# EAGLE design wordclock_final (EAGLE 7.1.0)
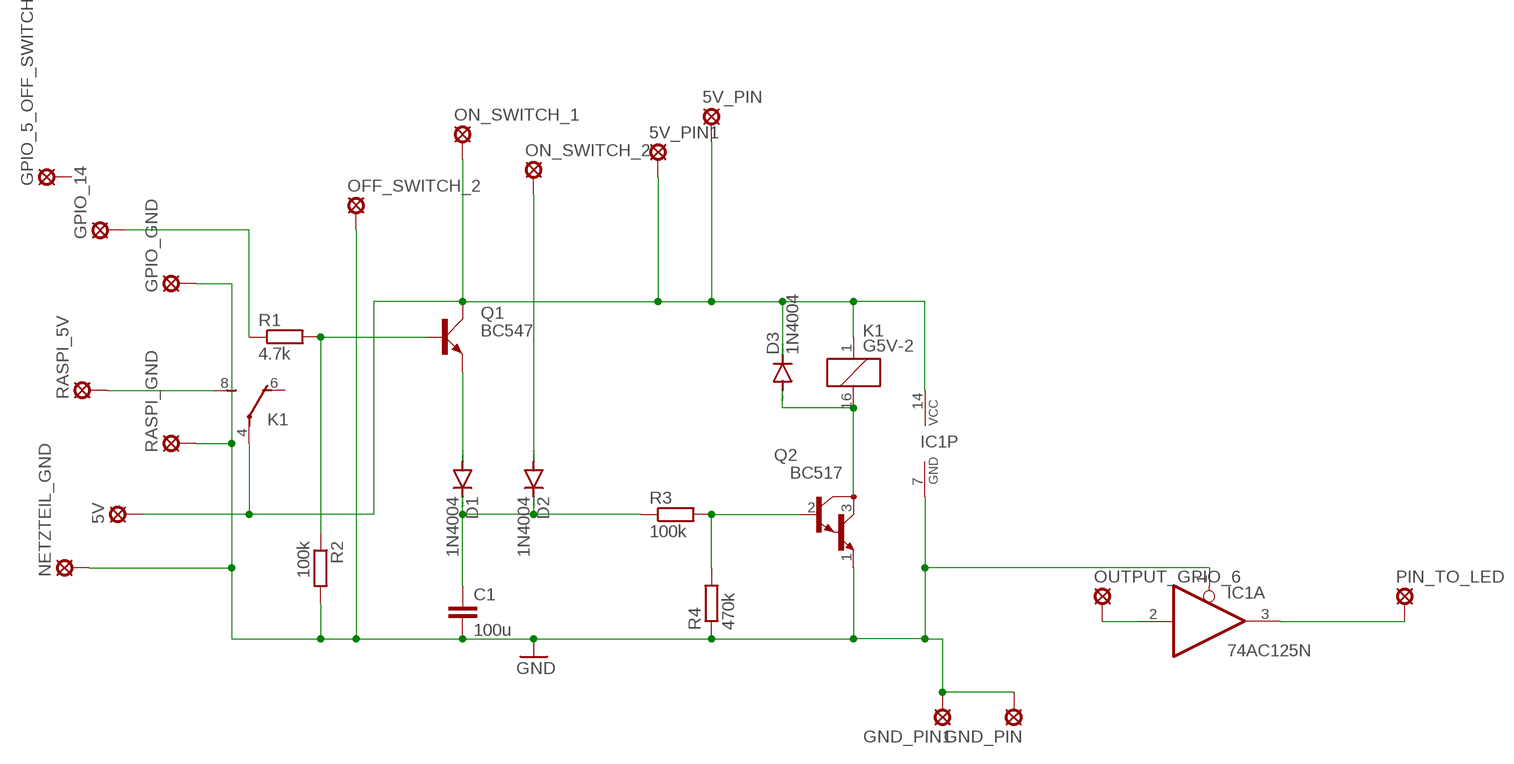
[diagram p0: schematic, sheet 1]

## Parts
5V  SE14  [SE14]
5V_PIN  SE14  [SE14]
5V_PIN1  SE14  [SE14]
C1  100u  C-EU025-060X050  [C025-060X050]
D1  1N4004  [DO41-10]
D2  1N4004  [DO41-10]
D3  1N4004  [DO41-10]
GND_PIN  SE14  [SE14]
GND_PIN1  SE14  [SE14]
GPIO_5_OFF_SWITCH  SE14  [SE14]
GPIO_14  SE14  [SE14]
GPIO_GND  SE14  [SE14]
IC1  74AC125N  [DIL14]
K1  G5V-2  [G5V-2]
NETZTEIL_GND  SE14  [SE14]
OFF_SWITCH_2  SE14  [SE14]
ON_SWITCH_1  SE14  [SE14]
ON_SWITCH_2  SE14  [SE14]
OUTPUT_GPIO_6  SE14  [SE14]
PIN_TO_LED  SE14  [SE14]
Q1  BC547  [SOT54A]
Q2  BC517  [TO92]
R1  4.7k  R-EU_0207/10  [0207/10]
R2  100k  R-EU_0207/10  [0207/10]
R3  100k  R-EU_0207/10  [0207/10]
R4  470k  R-EU_0207/10  [0207/10]
RASPI_5V  SE14  [SE14]
RASPI_GND  SE14  [SE14]

## Nets
GND: C1.2 GND_PIN1.MP GND_PIN.MP GPIO_GND.MP IC1.1(A:OE) IC1.7(P:GND) NETZTEIL_GND.MP OFF_SWITCH_2.MP Q2.1(E) R2.2 R4.1 RASPI_GND.MP
N$1: Q1.B R1.2 R2.1
N$2: D1.A Q1.E
N$3: D2.A ON_SWITCH_2.MP
N$4: IC1.2(A:I) OUTPUT_GPIO_6.MP
N$5: Q2.2(B) R3.2 R4.2
N$6: D3.A K1.16 Q2.3(C)
N$7: 5V.MP 5V_PIN1.MP 5V_PIN.MP D3.C IC1.14(P:VCC) K1.1 K1.4(1:P) ON_SWITCH_1.MP Q1.C
N$8: C1.1 D1.C D2.C R3.1
N$10: GPIO_14.MP R1.1
N$11: K1.8(1:S) RASPI_5V.MP
N$12: IC1.3(A:O) PIN_TO_LED.MP
Unconnected: GPIO_5_OFF_SWITCH.MP IC1.4(B:OE) IC1.5(B:I) IC1.6(B:O) IC1.8(C:O) IC1.9(C:I) IC1.10(C:OE) IC1.11(D:O) IC1.12(D:I) IC1.13(D:OE) K1.6(1:O) K1.9(2:S) K1.11(2:O) K1.13(2:P)

## Library data of the parts
5V 5V_PIN 5V_PIN1 GND_PIN GND_PIN1 GPIO_5_OFF_SWITCH GPIO_14 GPIO_GND NETZTEIL_GND OFF_SWITCH_2 ON_SWITCH_1 ON_SWITCH_2 OUTPUT_GPIO_6 PIN_TO_LED RASPI_5V RASPI_GND = solpad:SE14: SOLDER PAD E1553, drill 1,4mm, distributor Buerklin, 07F820
C1 = rcl:C-EU: CAPACITOR, European symbol; SPICEPREFIX: C
D1-D3 = diode:1N4004: DIODE general purpose rectifier, 1 A
IC1 = 74xx-eu:74*125: Quad bus BUFFER, 3-state
K1 = relay:G5V-2: OMRON PCB Relay Source: http://www.omron.com/ecb/products/pdf/en-g5v2.pdf; MPN: G5V-2 5DC; OC_FARNELL: 9949488; OC_NEWARK: 78K5703
Q1 = transistor-small-signal:BC547: NPN TRANSISTOR
Q2 = transistor-npn:BC517*: NPN Darlington Transistor
R1-R4 = rcl:R-EU_: RESISTOR, European symbol; SPICEPREFIX: R

## Board
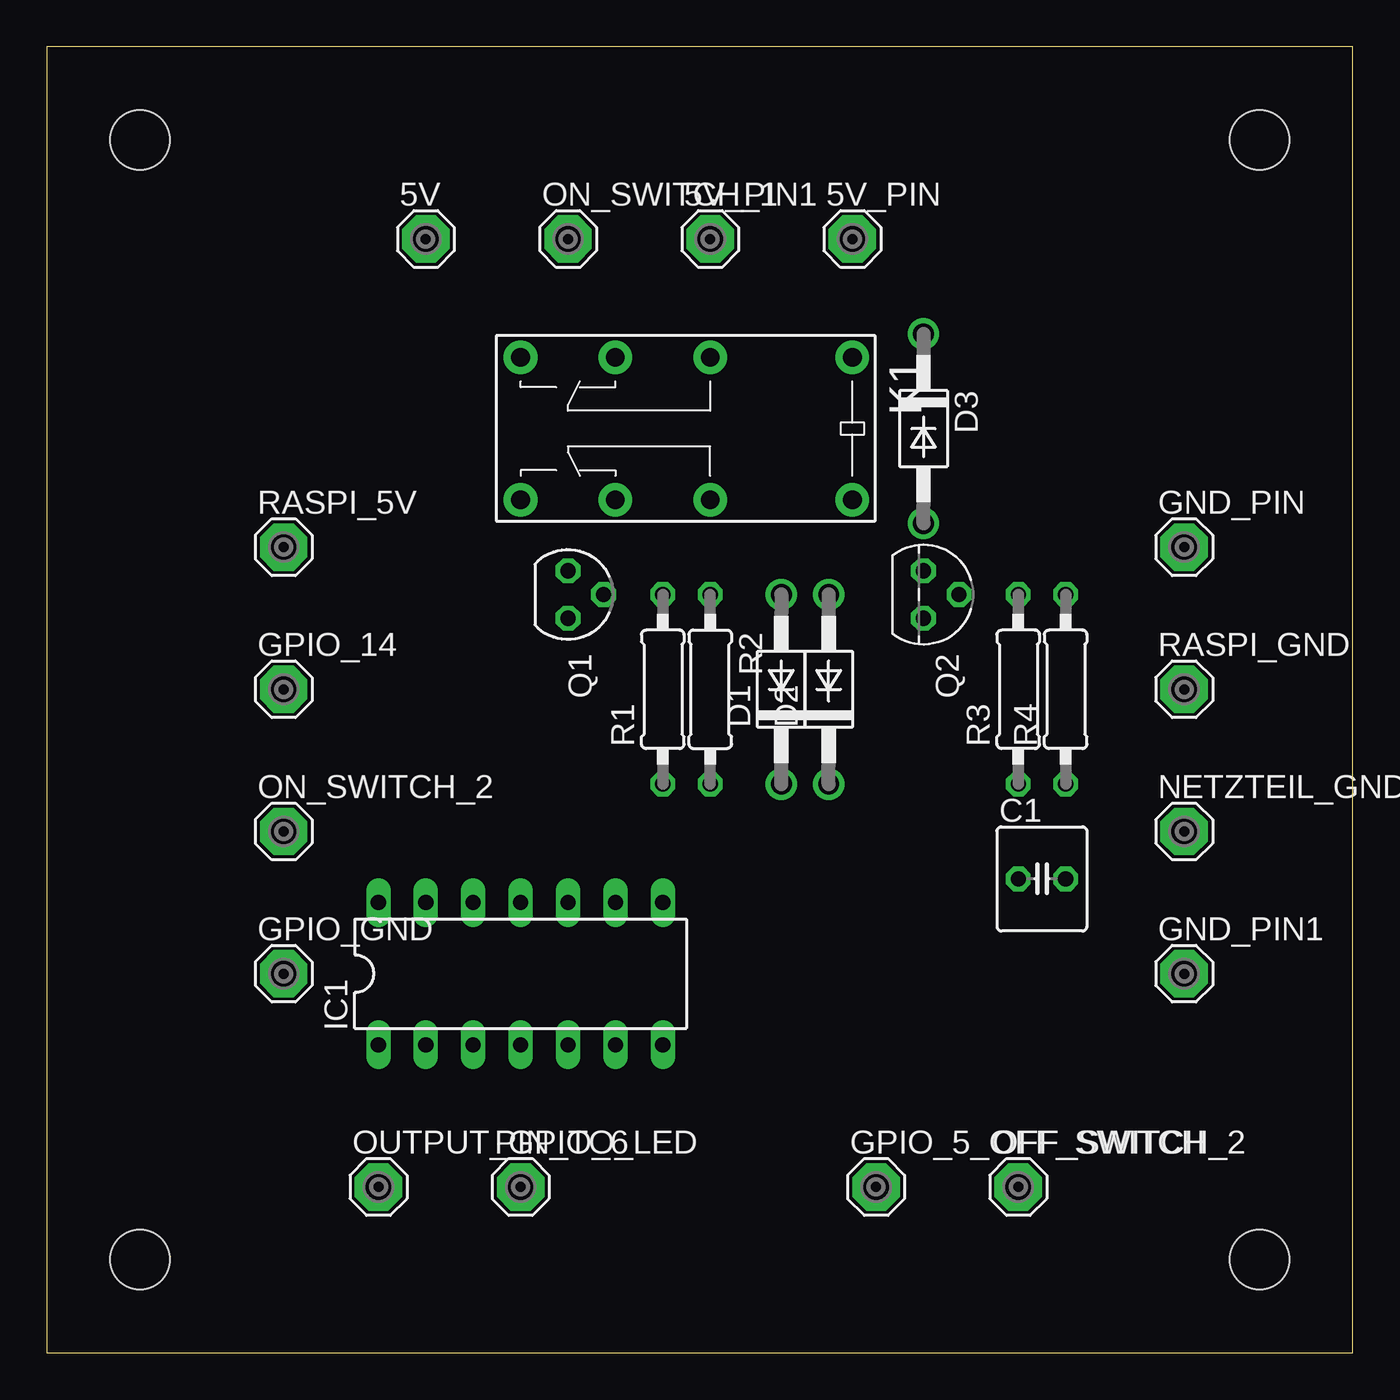
[diagram p1: board, top side]
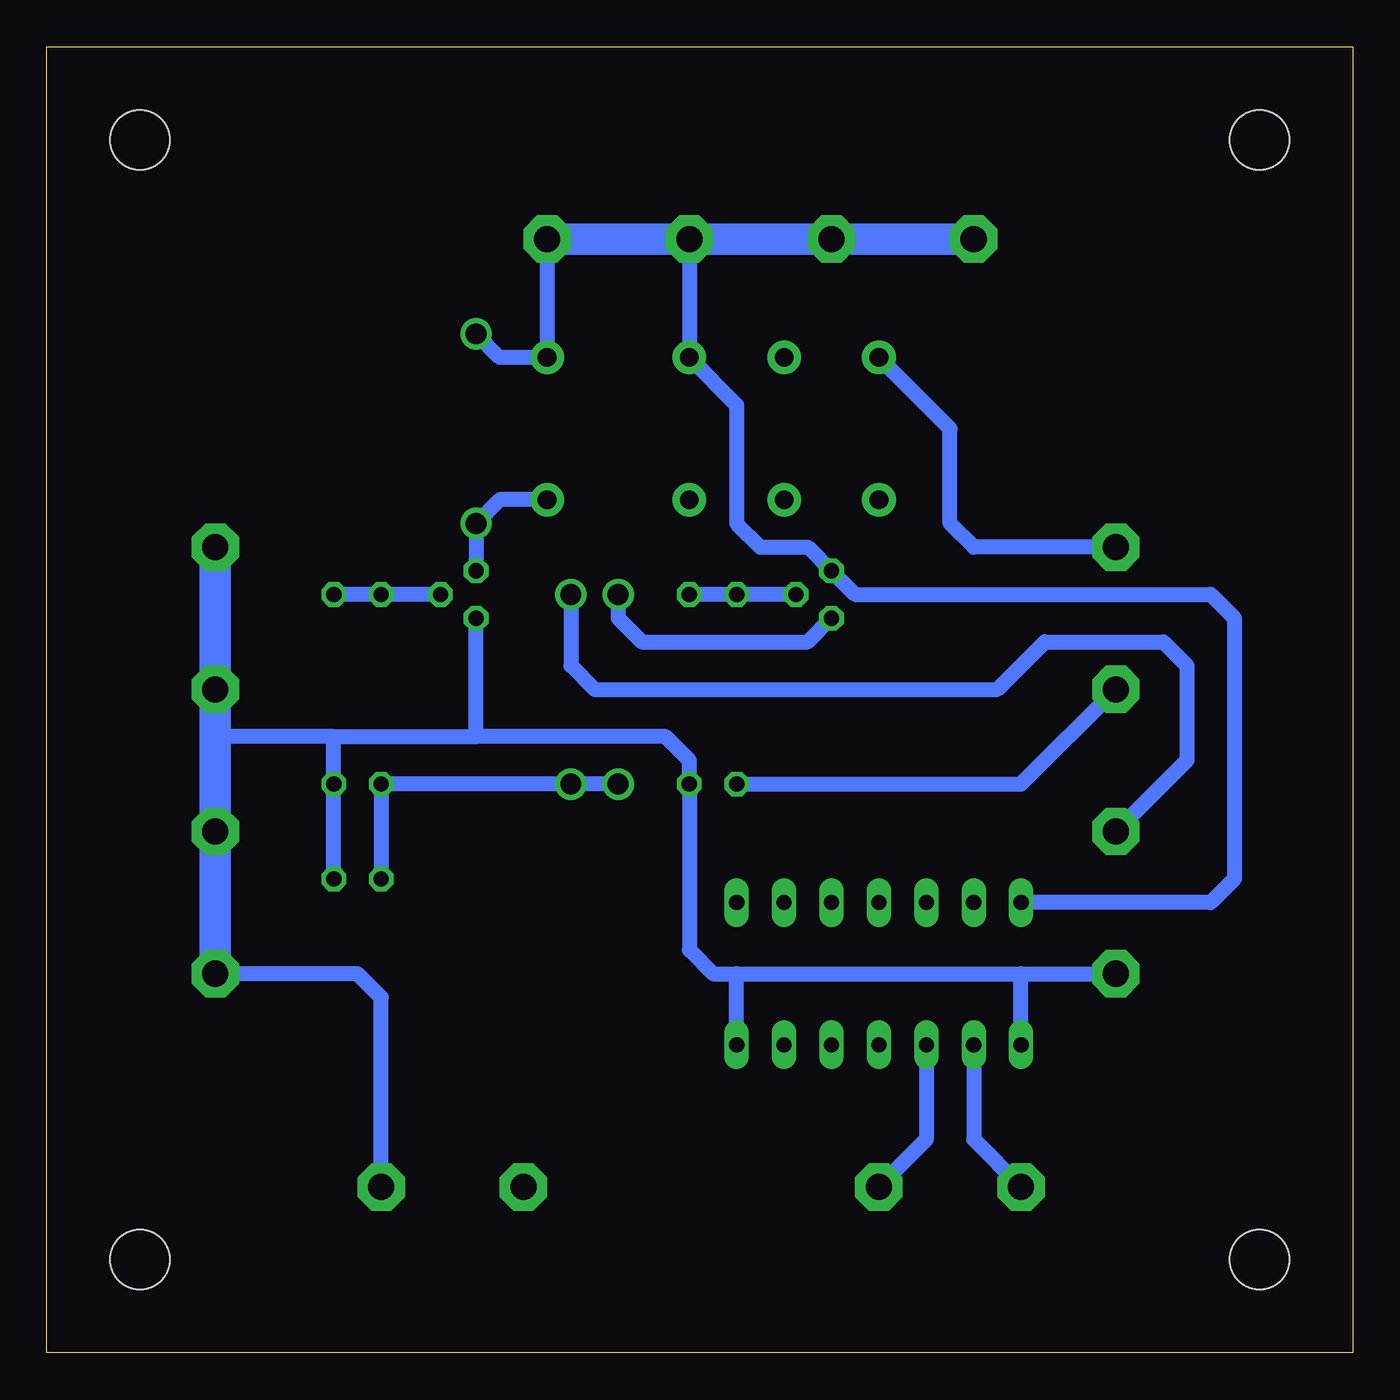
[diagram p2: board, bottom side, seen from below]

Size 70 x 70 mm. Coordinates in mm from the lower left corner, seen from the top.
Outline: 0,0 70,0 70,70 0,70 0,0
Copper layers (1*16): Top 0.035mm / dielectric 1.5mm / Bottom 0.035mm
Design rules "default": minimum track width 10mil, minimum drill 24mil, track to track 8mil, track to pad 8mil, pad to pad 8mil, via to via 8mil, smd to smd 8mil, copper to edge 40mil, drill to drill 8mil, minimum pad ring 10mil, minimum via ring 8mil, stop-mask expansion 4mil, vias tented up to drill 0mil, thermal gap 10mil
Holes 3.2 mm at 5,5 5,65 65,65 65,5

### Footprints (pad centres in the part's own frame; a part is rotated, then mirrored left to right if it is on the bottom)
SE14 = drill 1.397 pad 2.54 octagon: MP 0,0
C025-060X050 = drill 0.813 octagon: 1 -1.27,0; 2 1.27,0
DO41-10 = drill 1.118: A 5.08,0; C -5.08,0
DIL14 = drill 0.813 long: 1 -7.62,-3.81; 2 -5.08,-3.81; 3 -2.54,-3.81; 4 0,-3.81; 5 2.54,-3.81; 6 5.08,-3.81; 7 7.62,-3.81; 8 7.62,3.81; 9 5.08,3.81; 10 2.54,3.81; 11 0,3.81; 12 -2.54,3.81; 13 -5.08,3.81; 14 -7.62,3.81
G5V-2 = drill 1 pad 1.8: 1 -8.89,-3.81; 4 -1.27,-3.81; 6 3.81,-3.81; 8 8.89,-3.81; 9 8.89,3.81; 11 3.81,3.81; 13 -1.27,3.81; 16 -8.89,3.81
SOT54A = drill 0.813 octagon: B 0,1.905; C -1.27,0; E 1.27,0
TO92 = drill 0.813 octagon: 1 1.27,0; 2 0,1.905; 3 -1.27,0
0207/10 = drill 0.813 octagon: 1 -5.08,0; 2 5.08,0

### Placement (x,y rotation side)
5V  20.32,59.69 0 top
5V_PIN  43.18,59.69 0 top
5V_PIN1  35.56,59.69 0 top
C1  53.34,25.4 0 top
D1  39.37,35.56 90 top
D2  41.91,35.56 90 top
D3  46.99,49.53 270 top
GND_PIN  60.96,43.18 0 top
GND_PIN1  60.96,20.32 0 top
GPIO_5_OFF_SWITCH  44.45,8.89 0 top
GPIO_14  12.7,35.56 0 top
GPIO_GND  12.7,20.32 0 top
IC1  25.4,20.32 0 top
K1  34.29,49.53 180 top
NETZTEIL_GND  60.96,27.94 0 top
OFF_SWITCH_2  52.07,8.89 0 top
ON_SWITCH_1  27.94,59.69 0 top
ON_SWITCH_2  12.7,27.94 0 top
OUTPUT_GPIO_6  17.78,8.89 0 top
PIN_TO_LED  25.4,8.89 0 top
Q1  27.94,40.64 270 top
Q2  46.99,40.64 270 top
R1  33.02,35.56 90 top
R2  35.56,35.56 270 top
R3  52.07,35.56 90 top
R4  54.61,35.56 90 top
RASPI_5V  12.7,43.18 0 top
RASPI_GND  60.96,35.56 0 top

### Tracks (layer width: path | path; a pad name or v marks a point on that pad's centre or on a via)
GND
  Bottom 0.813: 46.99,33.02 36.83,33.02 35.56,31.75 R2.2 35.56,21.59 34.29,20.32 33.02,20.32 | 46.99,33.02 Q2.1 | C1.2 R4.1 54.61,33.02 | 54.61,33.02 46.99,33.02 | 54.61,33.02 60.96,33.02 | OFF_SWITCH_2.MP 52.07,19.05 53.34,20.32 GND_PIN1.MP | 33.02,20.32 17.78,20.32 | 17.78,20.32 GPIO_GND.MP | IC1.1 17.78,20.32 | IC1.7 33.02,20.32
  Bottom 1.676: GND_PIN.MP RASPI_GND.MP 60.96,33.02 NETZTEIL_GND.MP GND_PIN1.MP
N$1
  Bottom 0.813: Q1.B R1.2 R2.1
N$2
  Bottom 0.813: D1.A 39.37,39.37 38.1,38.1 29.21,38.1 Q1.E
N$3
  Bottom 0.813: D2.A 41.91,36.83 40.64,35.56 19.05,35.56 16.51,38.1 10.16,38.1 8.89,36.83 8.89,31.75 ON_SWITCH_2.MP
N$4
  Bottom 0.813: IC1.2 20.32,11.43 OUTPUT_GPIO_6.MP
N$5
  Bottom 0.813: Q2.2 R3.2 R4.2
N$6
  Bottom 0.813: K1.16 45.72,45.72 D3.A Q2.3
N$7
  Bottom 0.813: 5V_PIN.MP K1.1 45.72,53.34 D3.C | 5V_PIN1.MP K1.4 33.02,50.8 33.02,44.45 31.75,43.18 29.21,43.18 Q1.C 26.67,40.64 7.62,40.64 6.35,39.37 6.35,25.4 7.62,24.13 IC1.14
  Bottom 1.676: 5V.MP ON_SWITCH_1.MP 5V_PIN1.MP 5V_PIN.MP
N$8
  Bottom 0.813: D1.C D2.C R3.1 C1.1
N$10
  Bottom 0.813: R1.1 17.78,30.48 GPIO_14.MP
N$11
  Bottom 0.813: RASPI_5V.MP 20.32,43.18 21.59,44.45 21.59,49.53 K1.8
N$12
  Bottom 0.813: IC1.3 22.86,11.43 PIN_TO_LED.MP